# EAGLE design tmp117 (EAGLE 9.3.0)
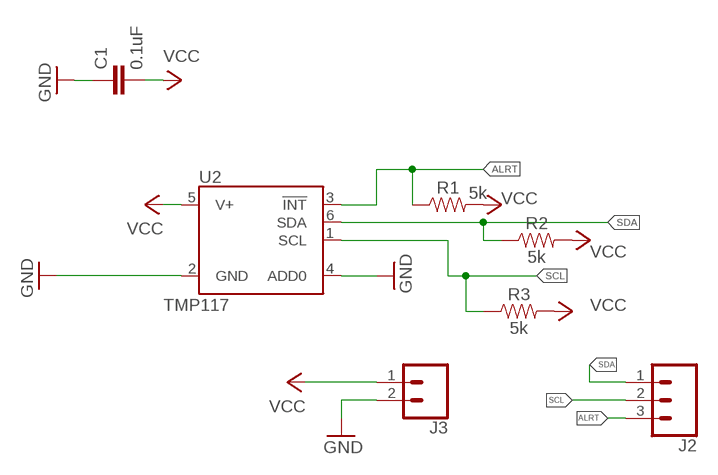
[diagram p0: schematic, sheet 1]

## Parts
C1  0.1uF  2.2UF-0603-10V-20%  [0603]
J2  CONN_03  [1X03]
J3  CONN_02  [1X02]
R1  5k  1.6KOHM-0603-1/10W-1%  [0603]
R2  5k  1.6KOHM-0603-1/10W-1%  [0603]
R3  5k  1.6KOHM-0603-1/10W-1%  [0603]
U2  TMP117  [TMP117]

## Nets
ALRT: J2.3 R1.1 U2.3(!INT)
GND: C1.1 J3.2 U2.2(GND) U2.4(ADD0)
SCL: J2.2 R3.1 U2.1(SCL)
SDA: J2.1 R2.1 U2.6(SDA)
VCC: C1.2 J3.1 R1.2 R2.2 R3.2 U2.5(V+)

## Library data of the parts
C1 = SparkFun-Capacitors:2.2UF: 2.2µF ceramic capacitors A capacitor is a passive two-terminal electrical component used to store electrical energy temporarily in an electric field.; PROD_ID: CAP-07888; VALUE: 2.2uF
J2 = SparkFun-Connectors:CONN_03: Multi connection point. Often used as Generic Header-pin footprint for 0.1 inch spaced/style header connections On any of the 0.1 inch spaced packages, you can populate with these: Break Away Headers - Straight <https://www.sparkfun.com/products/116> (PRT-00116) Break Away Male Headers - Right Angle <https://www.sparkfun.com/products/553> (PRT-00553) Female Headers <https://www.sparkfun.com/products/115> (PRT-00115) Break Away Headers - Machine Pin <https://www.sparkfun.com/products/117> (PRT-00117) Break Away Female Headers - Swiss Machine Pin <https://www.sparkfun.com/products/743> (PRT-00743) Stackable Header - 3 Pin (Female, 0.1") <https://www.sparkfun.com/products/13875> (PRT-13875) For SCREWTERMINALS and SPRING TERMINALS visit here: Screw Terimnals on SparkFun.com <https://www.sparkfun.com/search/results?term=Screw+Terminals> (5mm/3.5mm/2.54mm spacing) This device is also useful as a general connection point to wire up your design to another part of your project. Our various solder wires solder well into these plated through hole pads. Hook-Up Wire - Assortment (Stranded, 22 AWG) <https://www.sparkfun.com/products/11375> (PRT-11375) Hook-Up Wire - Assortment (Solid Core, 22 AWG) <https://www.sparkfun.com/products/11367> (PRT-11367) View the entire wire category on our website here <https://www.sparkfun.com/categories/141> Special notes: Molex polarized connector foot print use with SKU : PRT-08232 with associated crimp pins and housings.
J3 = SparkFun-Connectors:CONN_02: Multi connection point. Often used as Generic Header-pin footprint for 0.1 inch spaced/style header connections On any of the 0.1 inch spaced packages, you can populate with these: Break Away Headers - Straight <https://www.sparkfun.com/products/116> (PRT-00116) Break Away Male Headers - Right Angle <https://www.sparkfun.com/products/553> (PRT-00553) Female Headers <https://www.sparkfun.com/products/115> (PRT-00115) Break Away Headers - Machine Pin <https://www.sparkfun.com/products/117> (PRT-00117) Break Away Female Headers - Swiss Machine Pin <https://www.sparkfun.com/products/743> (PRT-00743) For SCREWTERMINALS and SPRING TERMINALS visit here: Screw Terimnals on SparkFun.com <https://www.sparkfun.com/search/results?term=Screw+Terminals> (5mm/3.5mm/2.54mm spacing) This device is also useful as a general connection point to wire up your design to another part of your project. Our various solder wires solder well into these plated through hole pads. Hook-Up Wire - Assortment (Stranded, 22 AWG) <https://www.sparkfun.com/products/11375> (PRT-11375) Hook-Up Wire - Assortment (Solid Core, 22 AWG) <https://www.sparkfun.com/products/11367> (PRT-11367) View the entire wire category on our website here <https://www.sparkfun.com/categories/141> Special notes: Molex polarized connector foot print use with: PRT-08233 with associated crimp pins and housings. 2.54_SCREWTERM for use with PRT-10571. 3.5mm Screw Terminal footprints for PRT-08084 5mm Screw Terminal footprints for use with PRT-08432
R1-R3 = SparkFun-Resistors:1.6KOHM: 1.6kΩ resistor A resistor is a passive two-terminal electrical component that implements electrical resistance as a circuit element. Resistors act to reduce current flow, and, at the same time, act to lower voltage levels within circuits. - Wikipedia; PROD_ID: RES-08361; VALUE: 1.6k
U2 = TMP117:TMP117: Temperature Sensor TMP117x High-Accuracy, Low-Power, Digital Temperature Sensor With SMBus™- and I2C-Compatible Interface

## Board
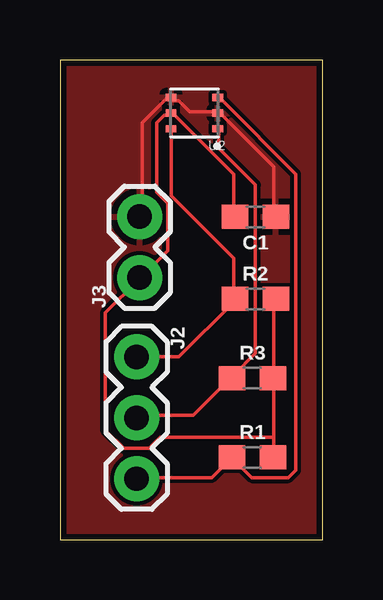
[diagram p1: board, top side]

Size 10.95 x 19.99 mm. Coordinates in mm from the lower left corner, seen from the top.
Outline: 0,0 10.95,0 10.95,19.99 0,19.99 0,0
Copper layers (1*16): Top 0.035mm / dielectric 1.5mm / Bottom 0.035mm
Design rules "SeeedStudio_2layer_DRU_no_angle_20140221": minimum track width 6mil, minimum drill 12mil, track to track 6mil, track to pad 6mil, pad to pad 6mil, via to via 6mil, smd to smd 0mil, copper to edge 10mil, drill to drill 10mil, minimum pad ring 10mil, minimum via ring 6mil, stop-mask expansion 2mil, vias tented up to drill 100mil, thermal gap 10mil

### Footprints (pad centres in the part's own frame; a part is rotated, then mirrored left to right if it is on the bottom)
0603 = smd 1.1 x 1: 1 -0.85,0; 2 0.85,0
1X03 = drill 1.016 pad 1.88: 1 0,0; 2 2.54,0; 3 5.08,0
1X02 = drill 1.016 pad 1.88: 1 0,0; 2 2.54,0
TMP117 = smd 0.45 x 0.3: 1 -0.975,0.65; 2 -0.975,0; 3 -0.975,-0.65; 4 0.975,-0.65; 5 0.975,0; 6 0.975,0.65

### Placement (x,y rotation side)
C1  8.14,13.46 180 top
J2  3.19,7.62 270 top
J3  3.32,10.92 90 top
R1  8.02,3.43 0 top
R2  8.14,10.03 0 top
R3  8.02,6.73 0 top
U2  5.6,17.78 180 top

### Tracks (layer width: path | path; a pad name or v marks a point on that pad's centre or on a via)
ALRT
  Top 0.152: U2.3 6.62,18.29 6.77,18.29 9.82,15.24 9.82,2.9 9.52,2.59 7.99,2.59 7.23,3.35 R1.1 7.08,3.35 6.32,2.59 3.27,2.59 J2.3
GND
  Top 0.152: C1.1 8.91,13.56 8.91,15.54 6.62,17.83 U2.2 6.47,17.83 5.4,17.83 4.94,18.29 4.64,18.29 U2.4 4.49,18.44 3.42,17.37 3.42,13.56 J3.2
  pour Top: -1,20.19 14,20.19 14,-0.81 -2,-0.81 -2,19.19
SCL
  Top 0.152: U2.1 6.62,17.07 6.62,16.31 8.14,14.78 8.14,7.77 7.23,6.86 R3.1 7.08,6.71 5.55,5.18 3.27,5.18 J2.2
SDA
  Top 0.152: U2.6 4.64,17.07 4.64,14.33 7.23,11.73 7.23,10.06 R2.1 7.23,9.91 4.94,7.62 J2.1
VCC
  Top 0.152: 8.91,4.27 8.91,6.71 R3.2 8.91,6.86 8.91,9.91 R2.2 | 8.91,4.27 8.91,3.51 R1.2 | C1.2 7.23,13.56 7.23,15.24 4.79,17.68 4.64,17.68 U2.5 4.49,17.68 4.33,17.68 4.03,17.37 4.03,14.48 4.49,14.02 4.49,12.04 3.42,10.97 J3.1 3.27,10.82 1.9,9.45 1.9,4.57 2.66,3.81 3.72,3.81 4.18,4.27 8.91,4.27